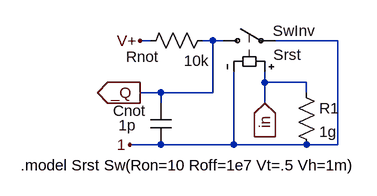
[diagram p0: schematic NotSw.asc]
NotSw.asc, the LTspice schematic file:
Version 4
SHEET 1 880 680
WIRE -112 176 -128 176
WIRE -96 256 -128 256
WIRE -96 272 -96 256
WIRE -96 336 -144 336
WIRE -16 176 -32 176
WIRE -16 256 -96 256
WIRE -16 256 -16 176
WIRE 0 176 -16 176
WIRE 16 336 -96 336
WIRE 16 336 16 224
WIRE 64 240 64 224
WIRE 64 272 64 240
WIRE 128 240 64 240
WIRE 128 256 128 240
WIRE 128 336 16 336
WIRE 176 176 80 176
WIRE 176 336 128 336
WIRE 176 336 176 176
FLAG -128 256 _Q
IOPIN -128 256 Out
FLAG 64 272 in
IOPIN 64 272 In
FLAG -144 336 1
FLAG -128 176 V+
SYMBOL sw -16 176 R270
WINDOW 0 15 92 VRight 0
WINDOW 3 -22 93 VRight 0
SYMATTR InstName SwInv
SYMATTR Value Srst
SYMBOL cap -112 272 R0
WINDOW 0 -58 12 Left 0
WINDOW 3 -49 34 Left 0
WINDOW 39 -97 57 Left 0
SYMATTR InstName Cnot
SYMATTR Value 1p
SYMBOL res -16 160 R90
WINDOW 0 56 108 VBottom 0
WINDOW 3 31 25 VTop 0
SYMATTR InstName Rnot
SYMATTR Value 10k
SYMBOL res 112 240 R0
SYMATTR InstName R1
SYMATTR Value 1g
TEXT -312 368 Left 0 !.model Srst Sw(Ron=10 Roff=1e7 Vt=.5 Vh=1m)

The netlist it stands for:
* NotSw.asc
SwInv _Q 1 in 1 Srst
Cnot _Q 1 1p
Rnot _Q V+ 10k
R1 in 1 1g
.model Srst Sw(Ron=10 Roff=1e7 Vt=.5 Vh=1m)
.backanno
.end